# EAGLE design DummyLoad_Frontpanel (EAGLE 8.6.3)
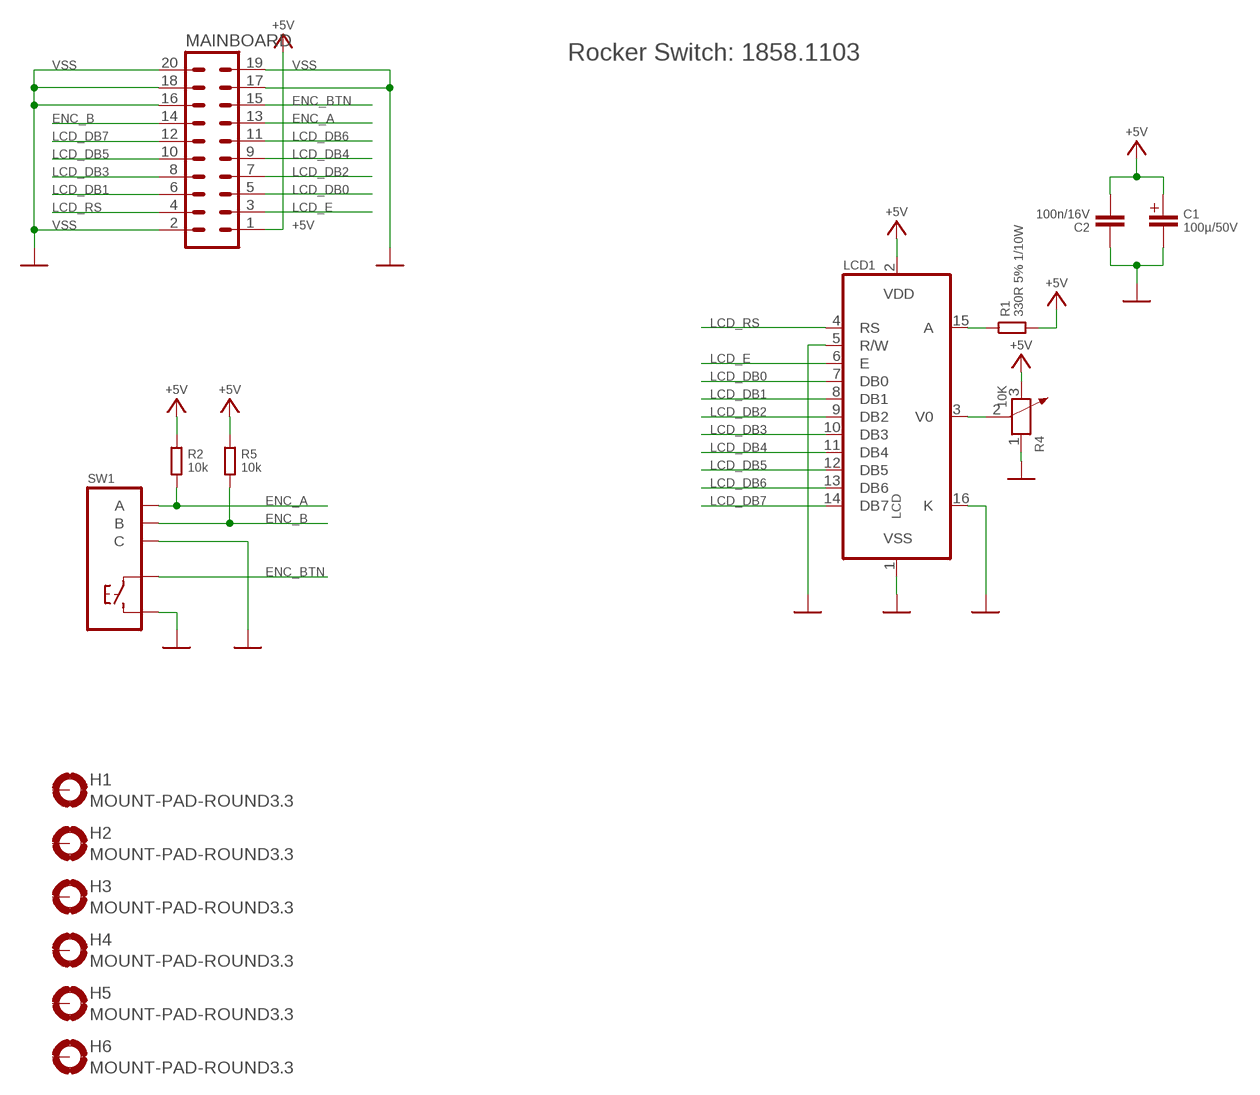
[diagram p0: schematic, sheet 1]

## Parts
C1  100µ/50V  C+3.5/8  [C+/3.5/8]
C2  100n/16V  CC/0805  [0805]
H1  MOUNT-PAD-ROUND3.3  [3,3-PAD]
H2  MOUNT-PAD-ROUND3.3  [3,3-PAD]
H3  MOUNT-PAD-ROUND3.3  [3,3-PAD]
H4  MOUNT-PAD-ROUND3.3  [3,3-PAD]
H5  MOUNT-PAD-ROUND3.3  [3,3-PAD]
H6  MOUNT-PAD-ROUND3.3  [3,3-PAD]
LCD1  LCD  [DISPLAYTECH-204C]
MAINBOARD  MA10-2  [MA10-2]
R1  330R 5% 1/10W  R-SMD0805  [C0805K]
R2  10k  R-SMD0805  [C0805K]
R4  10K  TRIMPOT  [ADJR3-7.0X7.0X5.0MM]
R5  10k  R-SMD0805  [C0805K]
SW1  EC12E-SW  [EC12E-SW]

## Nets
+5V: C1.+ C2.2 LCD1.2(VDD) MAINBOARD.1 R1.2 R2.1 R4.3 R5.1
ENC_A: MAINBOARD.13 R2.2 SW1.A
ENC_B: MAINBOARD.14 R5.2 SW1.B
ENC_BTN: MAINBOARD.15 SW1.1
LCD_DB0: LCD1.7(DB0) MAINBOARD.5
LCD_DB1: LCD1.8(DB1) MAINBOARD.6
LCD_DB2: LCD1.9(DB2) MAINBOARD.7
LCD_DB3: LCD1.10(DB3) MAINBOARD.8
LCD_DB4: LCD1.11(DB4) MAINBOARD.9
LCD_DB5: LCD1.12(DB5) MAINBOARD.10
LCD_DB6: LCD1.13(DB6) MAINBOARD.11
LCD_DB7: LCD1.14(DB7) MAINBOARD.12
LCD_E: LCD1.6(E) MAINBOARD.3
LCD_RS: LCD1.4(RS) MAINBOARD.4
N$4: LCD1.3(V0) R4.2
N$7: LCD1.15(A) R1.1
VSS: C1.- C2.1 LCD1.1(VSS) LCD1.5(R/W) LCD1.16(K) MAINBOARD.2 MAINBOARD.16 MAINBOARD.17 MAINBOARD.18 MAINBOARD.19 MAINBOARD.20 R4.1 SW1.2 SW1.C
Unconnected: H1.B3,3(MOUNT) H2.B3,3(MOUNT) H3.B3,3(MOUNT) H4.B3,3(MOUNT) H5.B3,3(MOUNT) H6.B3,3(MOUNT)

## Notes on the sheet
- Rocker Switch: 1858.1103

## Library data of the parts
C1 = neumluc:C+; OC_MOUSER: 667-EEU-FR1H101
C2 = goujine:C: Kondensator; OC_MOUSER: 810-C2012X7R2A104K
H1-H6 = holes:MOUNT-PAD-ROUND: MOUNTING PAD, round; SCREW: M3x5
LCD1 = neumluc:LCD; OC_MOUSER: 992-LCD-20X4Y
MAINBOARD = con-lstb:MA10-2: PIN HEADER; OC_FARNELL: unknown; OC_MOUSER: 200-TSW10707FD; OC_NEWARK: unknown; OC_RS: 832-3516
R1 = neumluc:R-SMD: R SMD; OC_MOUSER: 652-CR0805FX-3300ELF
R2 R5 = neumluc:R-SMD: R SMD; OC_MOUSER: 652-CR0805-JW-103ELF
R4 = neumluc:TRIMPOT: 301040009; MPN: SX3362P; OC_MOUSER: 652-3362P-1-103LF
SW1 = goujine:EC12E-SW: ALPS ENCODER EC12-E with switch; OC_MOUSER: 652-PEC11R-4225F-S24

## Board
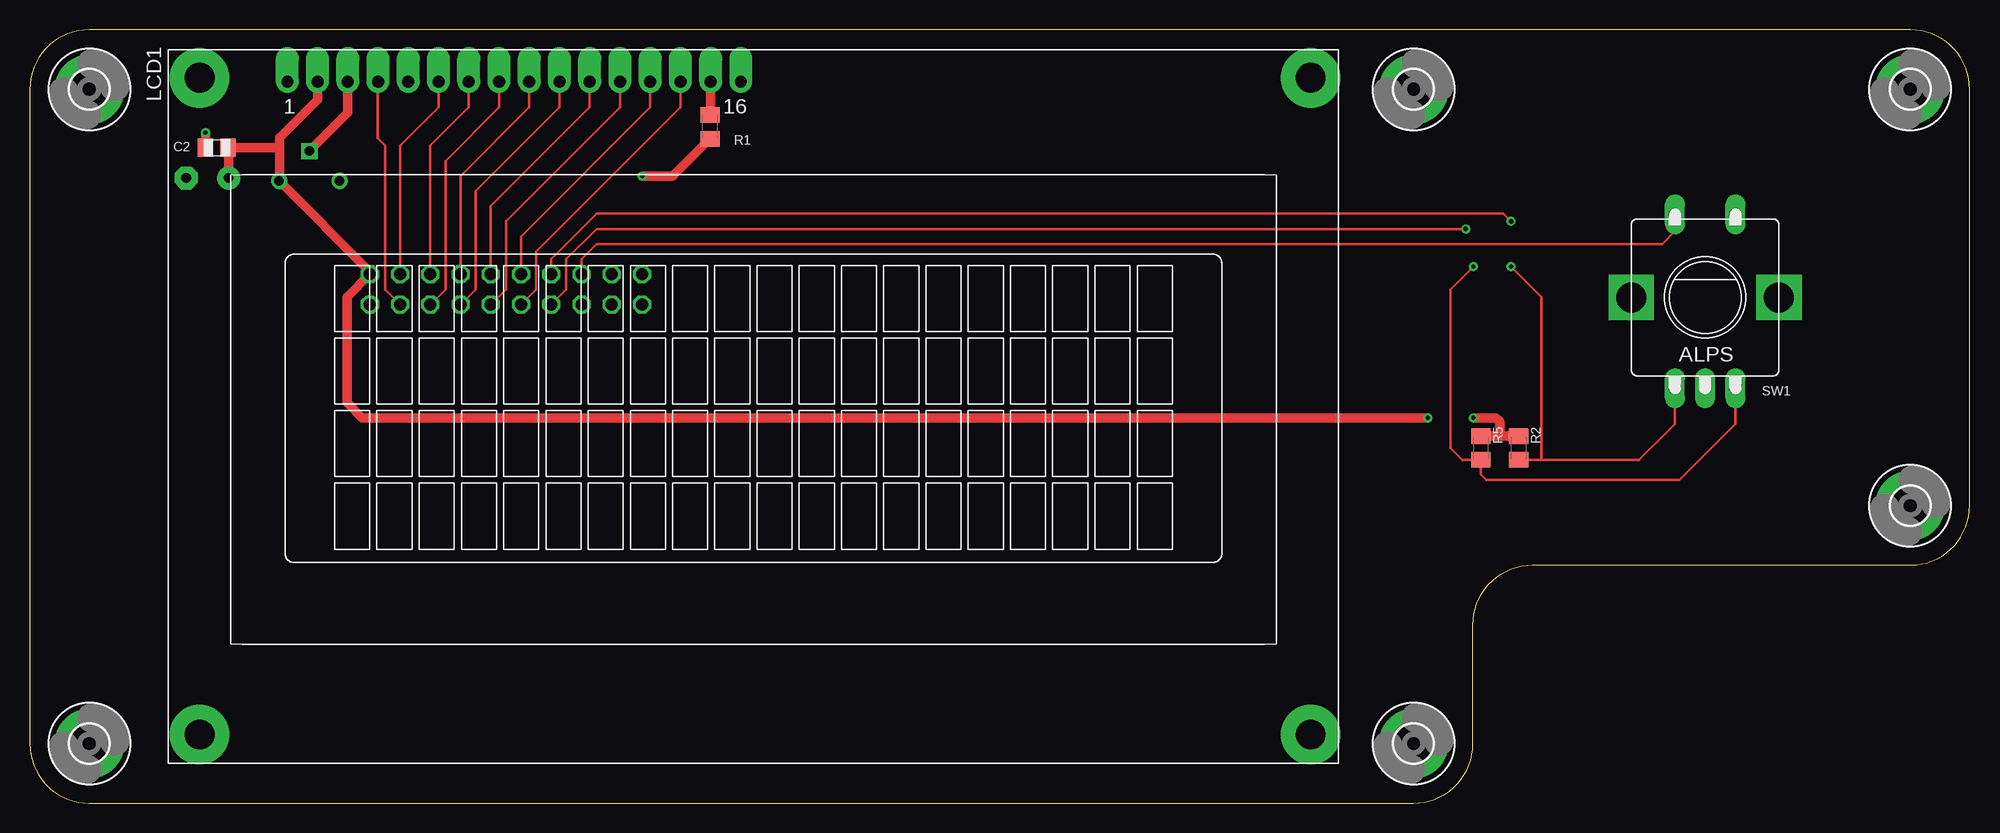
[diagram p1: board, top side]
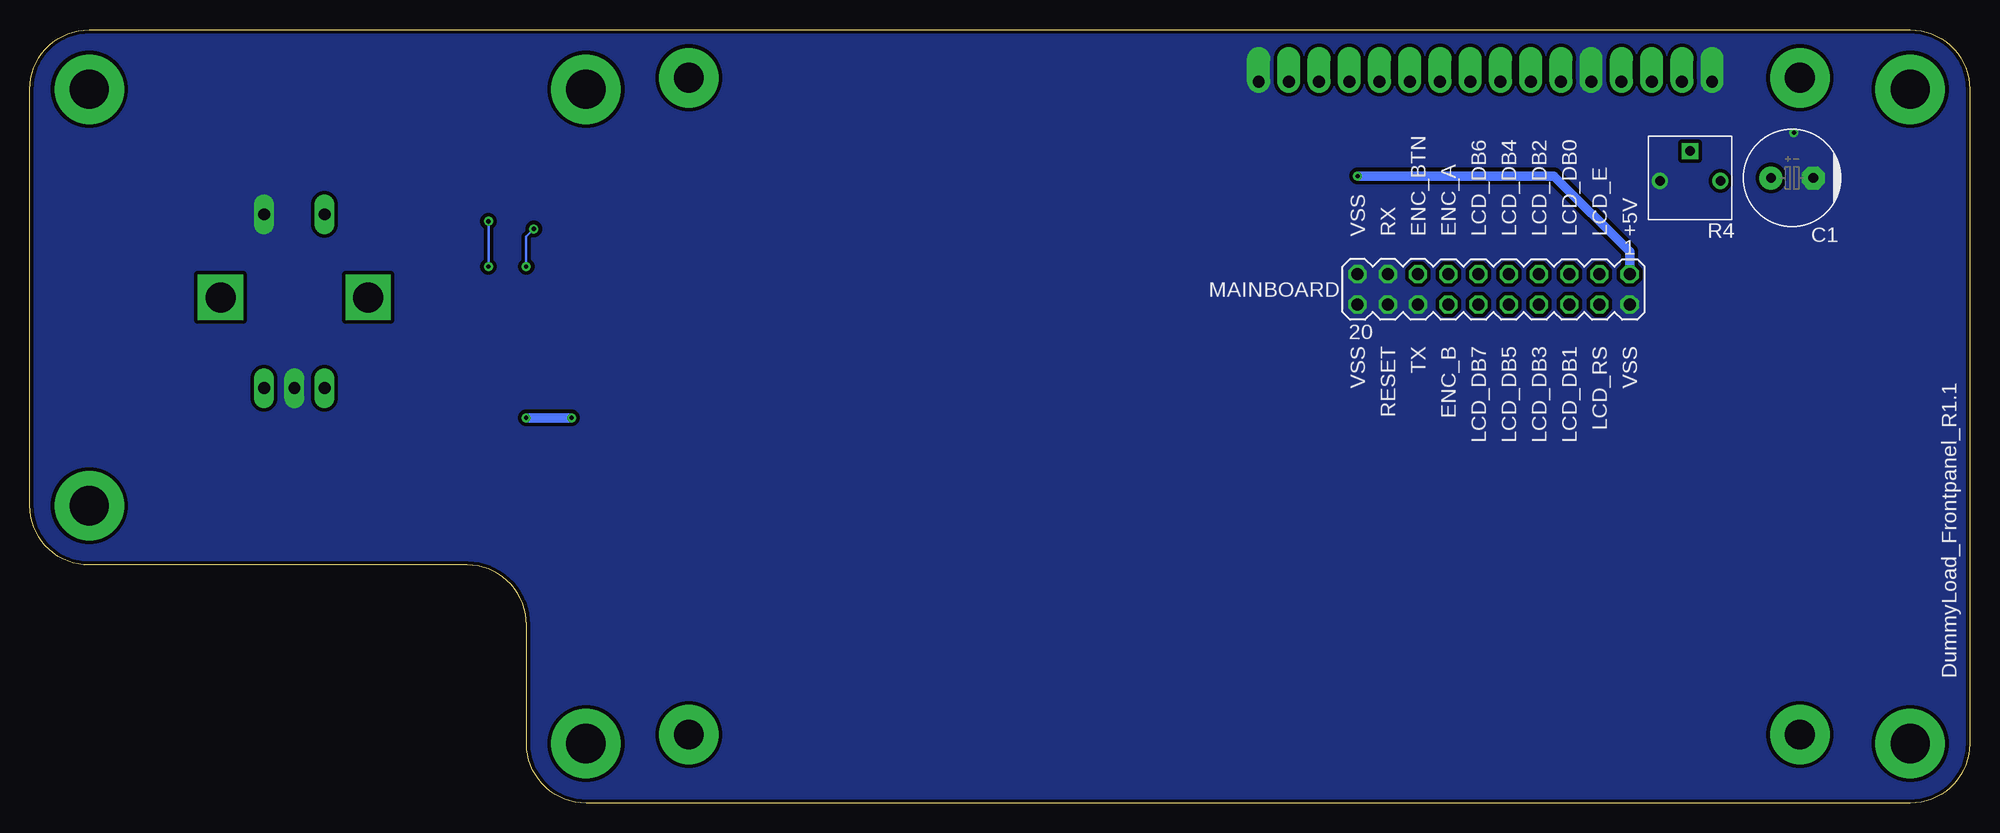
[diagram p2: board, bottom side, seen from below]

Size 163 x 65 mm. Coordinates in mm from the lower left corner, seen from the top.
Outline: 121.27,5 121.27,15 arc-90 126.27,20 158,20 arc90 163,25 163,60 arc90 158,65 5,65 arc90 0,60 0,5 arc90 5,0 116.27,0 arc90 121.27,5
Copper layers (1*16): Top 0.035mm / dielectric 1.5mm / Bottom 0.035mm
Design rules "default *": minimum track width 5mil, minimum drill 0.35mm, track to track 5mil, track to pad 5mil, pad to pad 5mil, via to via 5mil, smd to smd 5mil, copper to edge 8mil, drill to drill 6mil, minimum pad ring 10mil, minimum via ring 8mil, stop-mask expansion 4mil, vias tented up to drill 0mil, thermal gap 10mil

### Footprints (pad centres in the part's own frame; a part is rotated, then mirrored left to right if it is on the bottom)
C+/3.5/8 = drill 0.813 pad 1.93: + -1.778,0 | drill 0.813 pad 1.93 octagon: - 1.778,0
0805 = smd 1.3 x 1.5: 1 -0.953,0; 2 0.953,0
3,3-PAD = drill 3.3 pad 5.842: B3,3 0,0
DISPLAYTECH-204C = drill 1 pad 1.93 offset: 1 -39.154,27.3; 2 -36.614,27.3; 3 -34.074,27.3; 4 -31.534,27.3; 5 -28.994,27.3; 6 -26.454,27.3; 7 -23.914,27.3; 8 -21.374,27.3; 9 -18.834,27.3; 10 -16.294,27.3; 11 -13.754,27.3; 12 -11.214,27.3; 13 -8.674,27.3; 14 -6.134,27.3; 15 -3.594,27.3; 16 -1.054,27.3 | drill 2.5 pad 5: P$17 -46.525,27.625; P$18 -46.525,-27.575; P$19 46.825,27.625; P$20 46.825,-27.575
MA10-2 = drill 1.016 octagon: 1 -11.43,-1.27; 2 -11.43,1.27; 3 -8.89,-1.27; 4 -8.89,1.27; 5 -6.35,-1.27; 6 -6.35,1.27; 7 -3.81,-1.27; 8 -3.81,1.27; 9 -1.27,-1.27; 10 -1.27,1.27; 11 1.27,-1.27; 12 1.27,1.27; 13 3.81,-1.27; 14 3.81,1.27; 15 6.35,-1.27; 16 6.35,1.27; 17 8.89,-1.27; 18 8.89,1.27; 19 11.43,-1.27; 20 11.43,1.27
C0805K = smd 1.3 x 1.6: 1 -1,0; 2 1,0
ADJR3-7.0X7.0X5.0MM = drill 0.8 pad 1.35: 1 -2.54,-0.25; 3 2.54,-0.25 | drill 0.8 pad 1.35 square: 2 0,2.25
EC12E-SW = drill 1 pad 1.676 long: 1 -2.54,6.985; 2 2.54,6.985; A -2.54,-7.62; B 2.54,-7.62; C 0,-7.62 | drill 2.5 pad 3.81 square: MOUNT1 -6.2,0; MOUNT2 6.2,0

### Placement (x,y rotation side)
C1  14.92,52.55 0 bottom
C2  15.72,55.09 0 top
H1  5,60 0 top
H2  5,5 0 top
H3  116.27,5 0 top
H4  116.27,60 0 top
H5  158,60 0 top
H6  158,25 0 top
LCD1  60.8,33.34 0 top
MAINBOARD  40.01,43.18 180 bottom
R1  57.15,56.83 270 top
R2  125.09,29.84 270 top
R4  23.5,52.55 0 bottom
R5  121.92,29.84 270 top
SW1  140.76,42.5 0 top

### Tracks (layer width: path | path; a pad name or v marks a point on that pad's centre or on a via)
+5V  (via drill 0.35)
  Top 0.813: 21.01,55.09 21.01,52.35 R4.3 28.57,44.68 MAINBOARD.1 26.67,42.55 26.67,33.66 27.94,32.38 v117.47,32.38 | 21.01,55.09 C2.2 16.7,55.05 C1.+ | 21.01,55.09 21.01,55.94 24.19,59.11 LCD1.2 | v51.44,52.7 54.02,52.7 R1.2 | v121.28,32.38 123.19,32.38 123.51,32.07 123.51,30.84 | R5.1 123.51,30.84 | 123.51,30.84 R2.1
  Bottom 0.813: MAINBOARD.1 28.57,46.35 34.92,52.7 v51.44,52.7 | v117.47,32.38 v121.28,32.38
ENC_A  (via drill 0.35)
  Top 0.203: R2.2 127,28.84 | MAINBOARD.13 43.81,45.72 47.62,49.53 123.83,49.53 v124.46,48.9 | v124.46,45.09 127,42.55 127,28.84 | 127,28.84 135.21,28.84 138.22,31.86 SW1.A
  Bottom 0.203: v124.46,48.9 v124.46,45.09
ENC_B  (via drill 0.35)
  Top 0.203: MAINBOARD.14 45.09,43.18 45.09,45.72 47.62,48.26 v120.65,48.26 | v121.28,45.09 119.38,43.18 119.38,29.84 120.38,28.84 R5.2 121.92,27.62 122.4,27.15 138.59,27.15 143.31,31.86 SW1.B
  Bottom 0.203: v120.65,48.26 121.28,47.62 v121.28,45.09
ENC_BTN
  Top 0.203: MAINBOARD.15 46.35,45.72 47.62,46.99 137.16,46.99 138.22,48.05 SW1.1
LCD_DB0
  Top 0.203: MAINBOARD.5 33.66,55.24 36.89,58.48 LCD1.7
LCD_DB1
  Top 0.203: MAINBOARD.6 34.92,43.18 34.92,53.98 39.43,58.48 LCD1.8
LCD_DB2
  Top 0.203: MAINBOARD.7 36.2,52.7 41.97,58.48 LCD1.9
LCD_DB3
  Top 0.203: MAINBOARD.8 37.47,43.18 37.47,51.44 44.51,58.48 LCD1.10
LCD_DB4
  Top 0.203: MAINBOARD.9 38.73,50.16 47.05,58.48 LCD1.11
LCD_DB5
  Top 0.203: MAINBOARD.10 40.01,43.18 40.01,48.9 49.59,58.48 LCD1.12
LCD_DB6
  Top 0.203: MAINBOARD.11 41.27,47.62 52.13,58.48 LCD1.13
LCD_DB7
  Top 0.203: MAINBOARD.12 42.55,43.18 42.55,46.35 54.67,58.48 LCD1.14
LCD_E
  Top 0.203: MAINBOARD.3 31.11,55.24 34.35,58.48 LCD1.6
LCD_RS
  Top 0.203: MAINBOARD.4 29.84,43.18 29.84,55.24 29.21,55.88 29.21,60.58 LCD1.4
N$4
  Top 0.813: R4.2 26.73,58.03 LCD1.3
N$7
  Top 0.813: R1.1 57.21,57.89 LCD1.15
VSS  (via drill 0.35)
  Top 0.813: C2.1 v14.76,56.36
  pour Bottom (isolate 0.305, no thermals): 0,0 126.68,0 126.68,20 163,20 163,65 0,65

### Text on the board
bNames: +5V | LCD_E | LCD_DB0 | LCD_DB2 | LCD_DB4 | LCD_DB6 | ENC_A | ENC_BTN | RX | VSS | VSS | LCD_RS | LCD_DB1 | LCD_DB3 | LCD_DB5 | LCD_DB7 | ENC_B | TX | RESET | VSS | DummyLoad_Frontpanel_R1.1